# Altium schematic sheet root.SchDoc
size A3
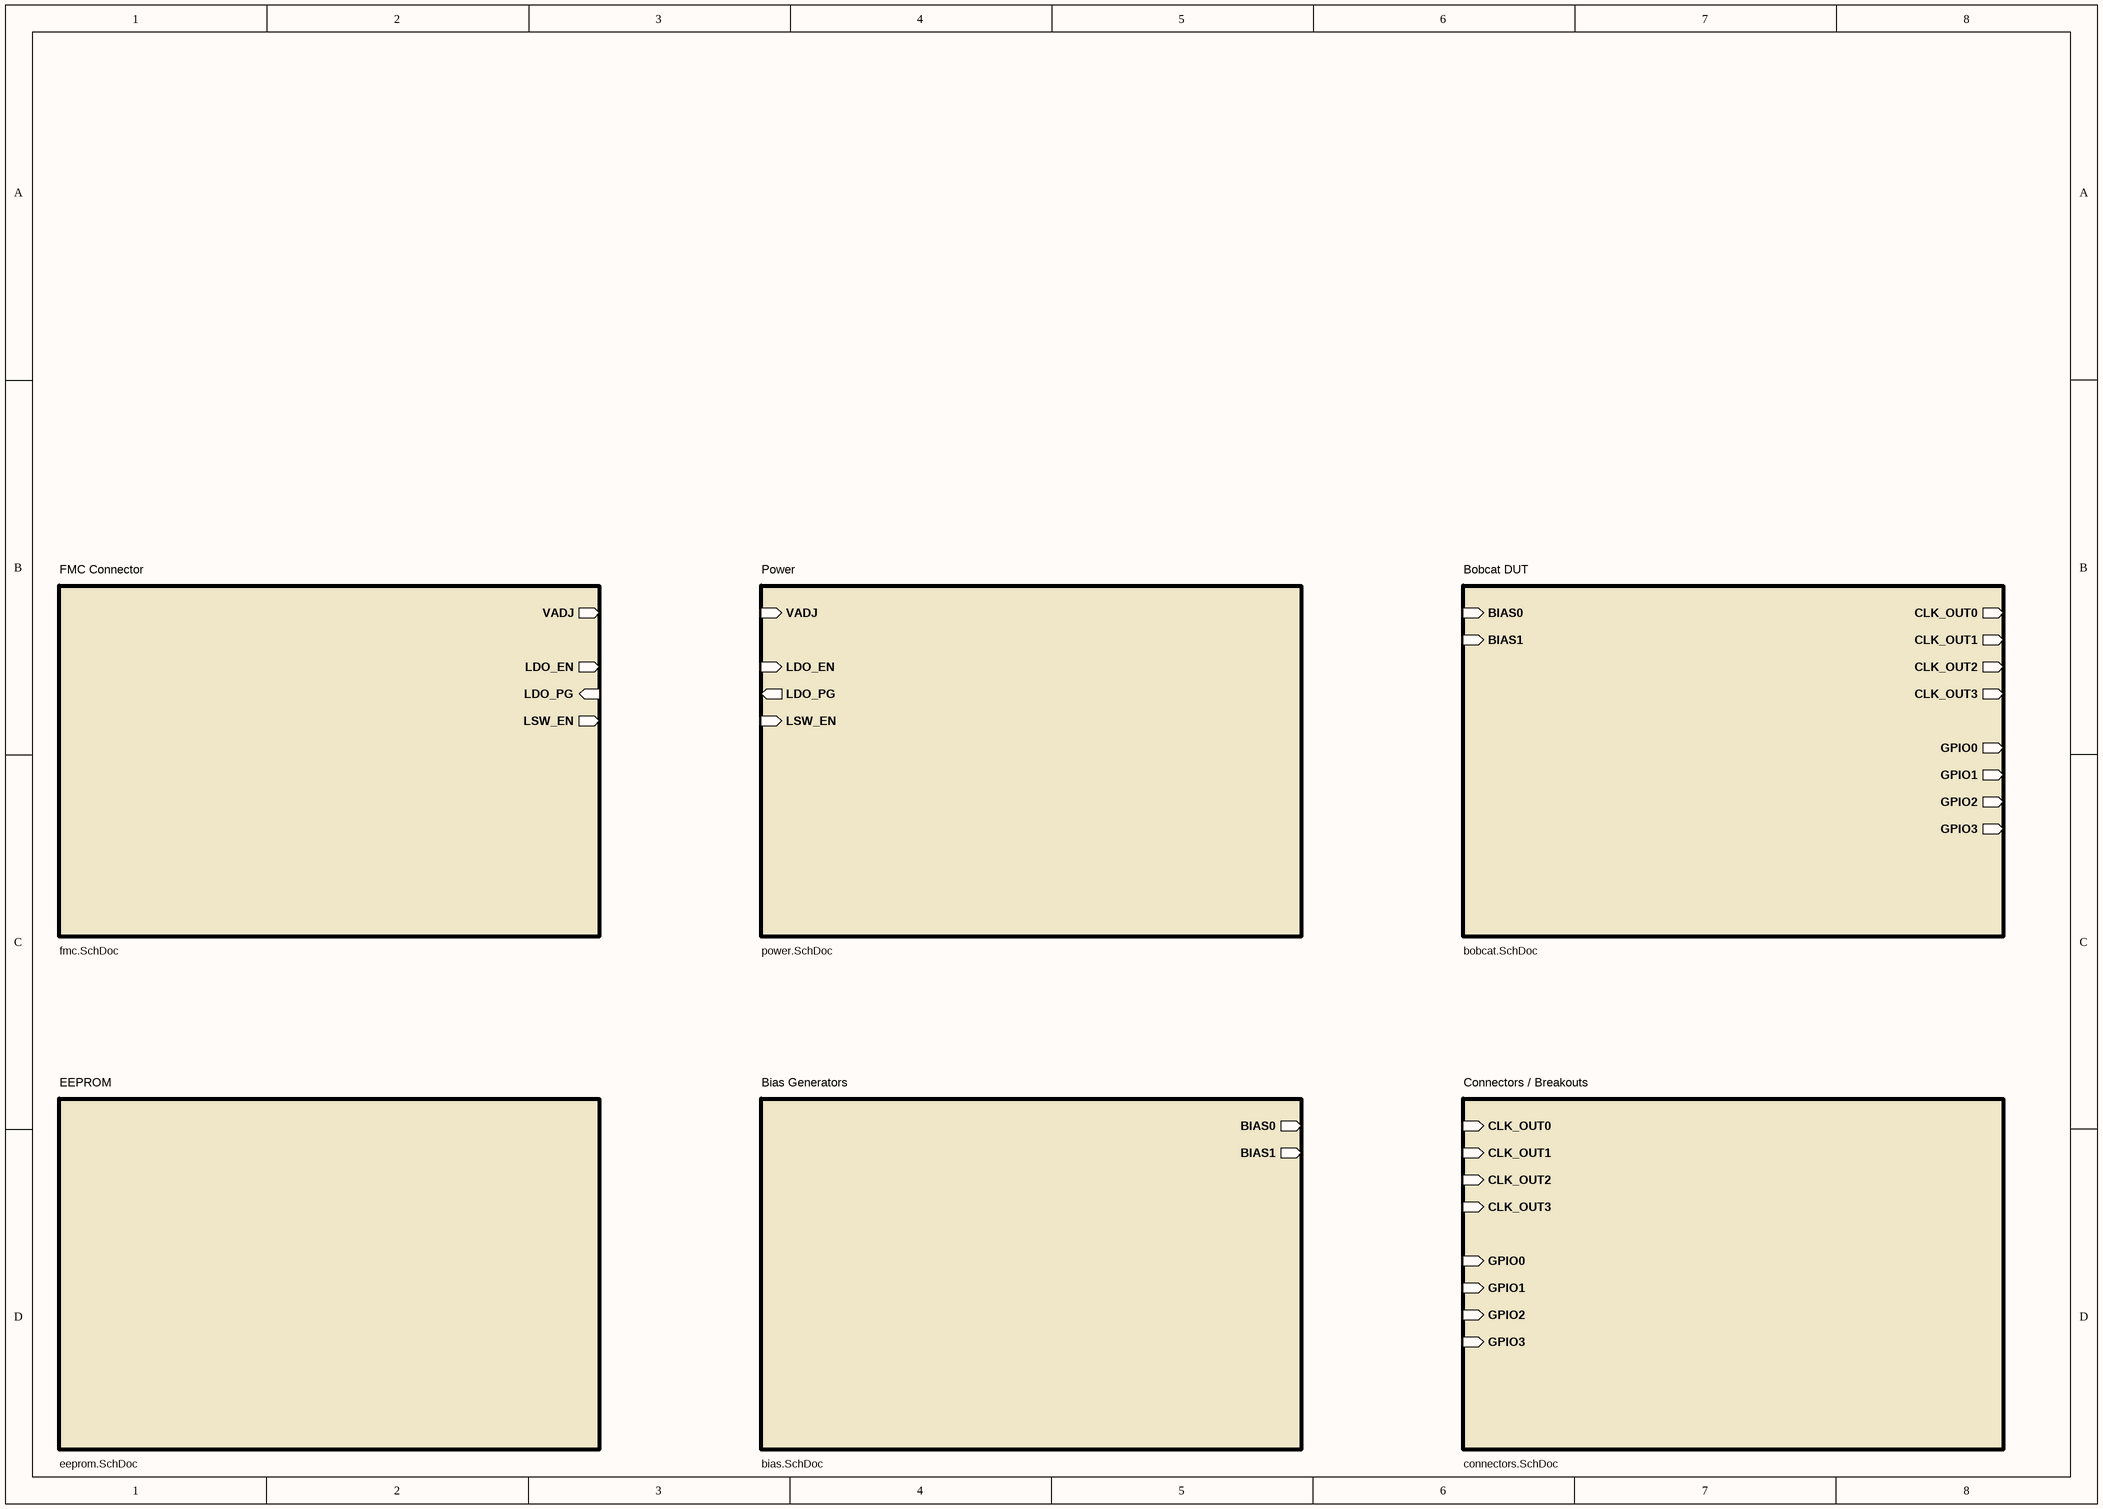
[diagram p0: root.SchDoc]

## Sub-sheets
Bias Generators = bias.SchDoc: BIAS0 (out), BIAS1 (out)
Bobcat DUT = bobcat.SchDoc: BIAS0 (in), BIAS1 (in), CLK_OUT0 (out), CLK_OUT1 (out), CLK_OUT2 (out), CLK_OUT3 (out), GPIO0 (out), GPIO1 (out), GPIO2 (out), GPIO3 (out)
Connectors / Breakouts = connectors.SchDoc: CLK_OUT0 (in), CLK_OUT1 (in), CLK_OUT2 (in), CLK_OUT3 (in), GPIO0 (in), GPIO1 (in), GPIO2 (in), GPIO3 (in)
EEPROM = eeprom.SchDoc: no entries
FMC Connector = fmc.SchDoc: VADJ (out), LDO_EN (out), LDO_PG (in), LSW_EN (out)
Power = power.SchDoc: VADJ (in), LDO_EN (in), LDO_PG (out), LSW_EN (in)